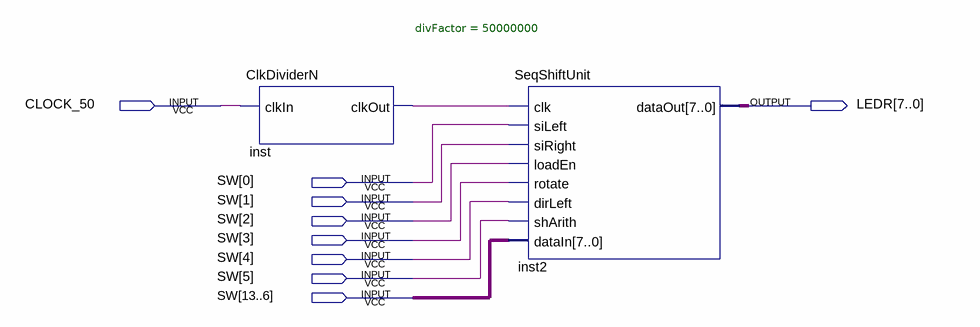
[diagram p0: schematic sheet]
// Quartus schematic SeqShiftUnit_Demo.bdf as structural Verilog: 2 symbols, 9 pins
module SeqShiftUnit_Demo (
  input  CLOCK_50,
  input  [13:0] SW,
  output [7:0] LEDR
);

  wire inst_clkout;

  ClkDividerN #(.divFactor(50000000)) inst (.clkIn(CLOCK_50), .clkOut(inst_clkout));
  SeqShiftUnit inst2 (
    .clk(inst_clkout), .siLeft(SW[0]), .siRight(SW[1]), .loadEn(SW[2]), .rotate(SW[3]), .dirLeft(SW[4]),
    .shArith(SW[5]), .dataIn(SW[13:6]), .dataOut(LEDR));
endmodule
